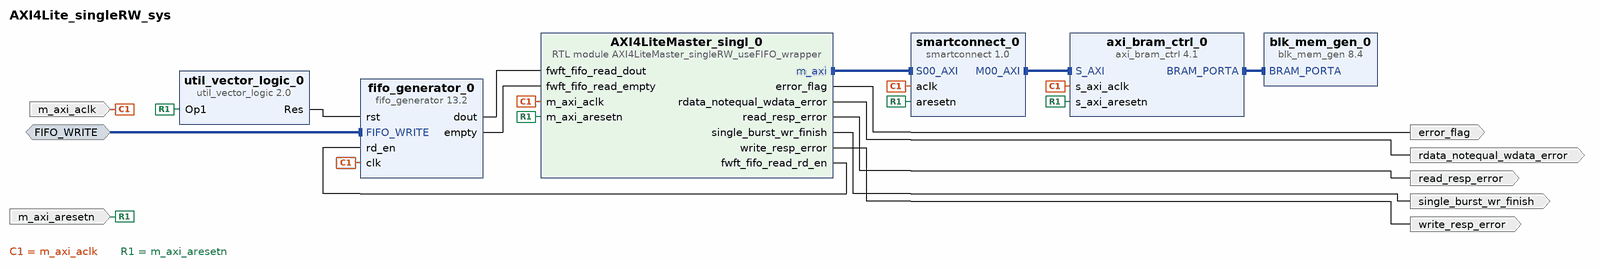
[diagram p0: block diagram of the top level]
# Vivado block design AXI4Lite_singleRW_sys, xcku040-ffva1156-2-i, Vivado 2021.2
create_bd_design AXI4Lite_singleRW_sys

create_bd_intf_port -mode Slave -vlnv xilinx.com:interface:fifo_write_rtl:1.0 FIFO_WRITE
create_bd_port -dir I -type clk m_axi_aclk
create_bd_port -dir I -type rst m_axi_aresetn
create_bd_port -dir O single_burst_wr_finish
create_bd_port -dir O error_flag
create_bd_port -dir O write_resp_error
create_bd_port -dir O read_resp_error
create_bd_port -dir O rdata_notequal_wdata_error

create_bd_cell -type ip -vlnv xilinx.com:ip:fifo_generator:13.2 fifo_generator_0
set_property -dict [list \
  CONFIG.Fifo_Implementation Common_Clock_Distributed_RAM \
  CONFIG.Full_Flags_Reset_Value 1 \
  CONFIG.Input_Data_Width 45 \
  CONFIG.Input_Depth 16 \
  CONFIG.Performance_Options First_Word_Fall_Through \
  CONFIG.Reset_Pin true \
  CONFIG.Reset_Type Asynchronous_Reset \
  CONFIG.Use_Dout_Reset true \
] [get_bd_cells fifo_generator_0]
create_bd_cell -type ip -vlnv xilinx.com:ip:blk_mem_gen:8.4 blk_mem_gen_0
set_property -dict [list \
  CONFIG.EN_SAFETY_CKT false \
  CONFIG.Enable_32bit_Address true \
  CONFIG.Register_PortA_Output_of_Memory_Primitives false \
  CONFIG.Use_RSTA_Pin true \
  CONFIG.use_bram_block BRAM_Controller \
] [get_bd_cells blk_mem_gen_0]
create_bd_cell -type ip -vlnv xilinx.com:ip:util_vector_logic:2.0 util_vector_logic_0
set_property -dict {CONFIG.C_OPERATION not CONFIG.C_SIZE 1} [get_bd_cells util_vector_logic_0]
create_bd_cell -type ip -vlnv xilinx.com:ip:axi_bram_ctrl:4.1 axi_bram_ctrl_0
set_property -dict {CONFIG.PROTOCOL AXI4LITE CONFIG.SINGLE_PORT_BRAM 1} [get_bd_cells axi_bram_ctrl_0]
create_bd_cell -type ip -vlnv xilinx.com:ip:smartconnect:1.0 smartconnect_0
set_property -dict {CONFIG.NUM_SI 1} [get_bd_cells smartconnect_0]
create_bd_cell -type module -reference AXI4LiteMaster_singleRW_useFIFO_wrapper AXI4LiteMaster_singl_0
set_property -dict {CONFIG.ADDR_WIDTH 13 CONFIG.RD_CHECK_EN 1} [get_bd_cells AXI4LiteMaster_singl_0]

# ---- connections ----

connect_bd_intf_net [get_bd_intf_pins smartconnect_0/S00_AXI] [get_bd_intf_pins AXI4LiteMaster_singl_0/m_axi]
connect_bd_intf_net -intf_net FIFO_WRITE_0_1 [get_bd_intf_ports FIFO_WRITE] [get_bd_intf_pins fifo_generator_0/FIFO_WRITE]
connect_bd_intf_net [get_bd_intf_pins axi_bram_ctrl_0/BRAM_PORTA] [get_bd_intf_pins blk_mem_gen_0/BRAM_PORTA]
connect_bd_intf_net [get_bd_intf_pins smartconnect_0/M00_AXI] [get_bd_intf_pins axi_bram_ctrl_0/S_AXI]
connect_bd_net [get_bd_pins AXI4LiteMaster_singl_0/error_flag] [get_bd_ports error_flag]
connect_bd_net [get_bd_pins AXI4LiteMaster_singl_0/fwft_fifo_read_rd_en] [get_bd_pins fifo_generator_0/rd_en]
connect_bd_net [get_bd_pins AXI4LiteMaster_singl_0/rdata_notequal_wdata_error] [get_bd_ports rdata_notequal_wdata_error]
connect_bd_net [get_bd_pins AXI4LiteMaster_singl_0/read_resp_error] [get_bd_ports read_resp_error]
connect_bd_net [get_bd_pins AXI4LiteMaster_singl_0/single_burst_wr_finish] [get_bd_ports single_burst_wr_finish]
connect_bd_net [get_bd_pins AXI4LiteMaster_singl_0/write_resp_error] [get_bd_ports write_resp_error]
connect_bd_net [get_bd_pins fifo_generator_0/dout] [get_bd_pins AXI4LiteMaster_singl_0/fwft_fifo_read_dout]
connect_bd_net [get_bd_pins fifo_generator_0/empty] [get_bd_pins AXI4LiteMaster_singl_0/fwft_fifo_read_empty]
connect_bd_net -net m_axi_aclk_0_1 [get_bd_ports m_axi_aclk] \
  [get_bd_pins fifo_generator_0/clk] [get_bd_pins axi_bram_ctrl_0/s_axi_aclk] [get_bd_pins smartconnect_0/aclk] \
  [get_bd_pins AXI4LiteMaster_singl_0/m_axi_aclk]
connect_bd_net -net m_axi_aresetn_0_1 [get_bd_ports m_axi_aresetn] \
  [get_bd_pins util_vector_logic_0/Op1] [get_bd_pins axi_bram_ctrl_0/s_axi_aresetn] [get_bd_pins smartconnect_0/aresetn] \
  [get_bd_pins AXI4LiteMaster_singl_0/m_axi_aresetn]
connect_bd_net [get_bd_pins util_vector_logic_0/Res] [get_bd_pins fifo_generator_0/rst]

# ---- address map ----
assign_bd_address -offset 0x0000 -range 4K -target_address_space [get_bd_addr_spaces AXI4LiteMaster_singl_0/m_axi] [get_bd_addr_segs axi_bram_ctrl_0/S_AXI/Mem0]

validate_bd_design
save_bd_design
